# Altium schematic sheet Sheet2.SchDoc
size A4; SheetNumber: 2; SheetTotal: 2
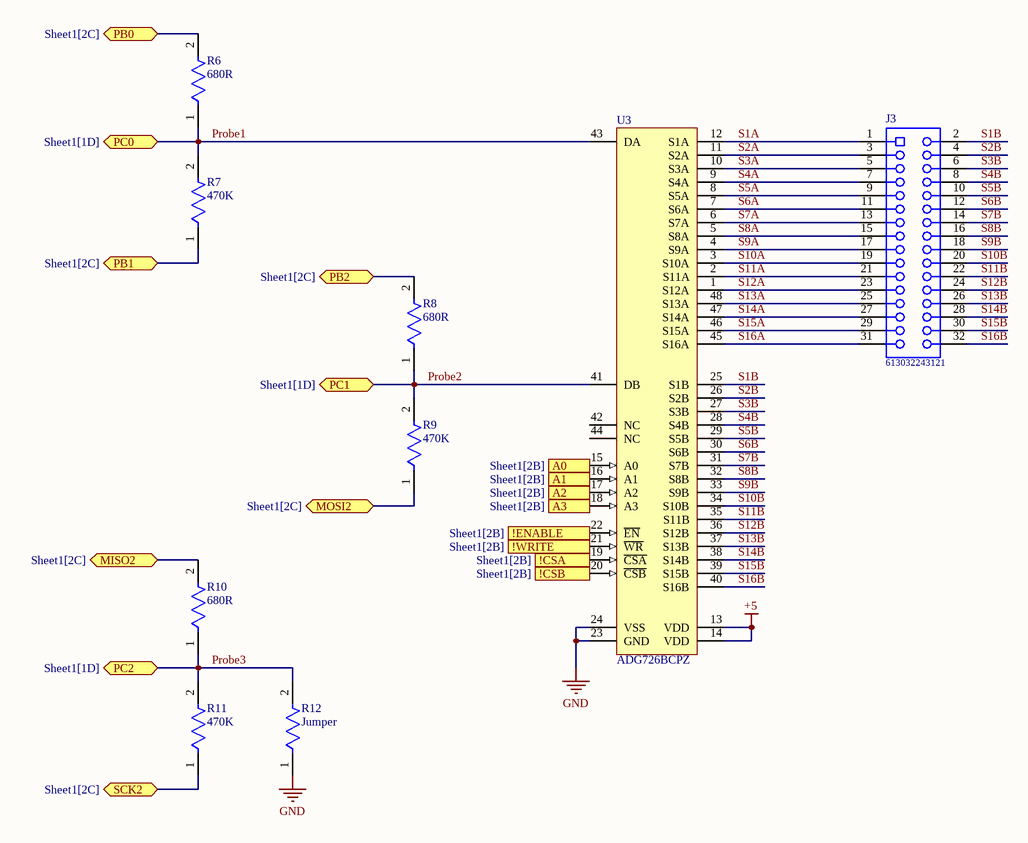
[diagram p0: Sheet2.SchDoc]

## Parts
J3  613032243121  [613032243121]
R6  680R  [FP-RMCF0805-IPC_B]  (no BOM)
R7  470K  [FP-RMCF0805-IPC_B]  (no BOM)
R8  680R  [FP-RMCF0805-IPC_B]  (no BOM)
R9  470K  [FP-RMCF0805-IPC_B]  (no BOM)
R10  680R  [FP-RMCF0805-IPC_B]  (no BOM)
R11  470K  [FP-RMCF0805-IPC_B]  (no BOM)
R12  Jumper  [FP-RMCF0805-IPC_B]  (no BOM)
U3  ADG726BCPZ  [ADG726 Breakout]  (no BOM)

## Ports
!CSA (in, see Sheet1[2B]), !CSB (in, see Sheet1[2B]), !ENABLE (in, see Sheet1[2B]), !WRITE (in, see Sheet1[2B]), A0 (in, see Sheet1[2B]), A1 (in, see Sheet1[2B]), A2 (in, see Sheet1[2B]), A3 (in, see Sheet1[2B]), MISO2 (bidir, see Sheet1[2C]), MOSI2 (bidir, see Sheet1[2C]), PB0 (bidir, see Sheet1[2C]), PB1 (bidir, see Sheet1[2C]), PB2 (bidir, see Sheet1[2C]), PC0 (bidir, see Sheet1[1D]), PC1 (bidir, see Sheet1[1D]), PC2 (bidir, see Sheet1[1D]), SCK2 (bidir, see Sheet1[2C])

## Nets
+5: U3.13(VDD) U3.14(VDD)
GND: R12.1 U3.23(GND) U3.24(VSS)
!CSA: U3.19(~{CSA}) ; port !CSA
!CSB: U3.20(~{CSB}) ; port !CSB
!ENABLE: U3.22(~{EN}) ; port !ENABLE
!WRITE: U3.21(~{WR}) ; port !WRITE
A0: U3.15(A0) ; port A0
A1: U3.16(A1) ; port A1
A2: U3.17(A2) ; port A2
A3: U3.18(A3) ; port A3
MISO2: R10.2 ; port MISO2
MOSI2: R9.1 ; port MOSI2
PB0: R6.2 ; port PB0
PB1: R7.1 ; port PB1
PB2: R8.2 ; port PB2
Probe1: R6.1 R7.2 U3.43(DA) ; port PC0
Probe2: R8.1 R9.2 U3.41(DB) ; port PC1
Probe3: R10.1 R11.2 R12.2 ; port PC2
S1A: J3.1 U3.12(S1A)
S1B: J3.2 U3.25(S1B)
S2A: J3.3 U3.11(S2A)
S2B: J3.4 U3.26(S2B)
S3A: J3.5 U3.10(S3A)
S3B: J3.6 U3.27(S3B)
S4A: J3.7 U3.9(S4A)
S4B: J3.8 U3.28(S4B)
S5A: J3.9 U3.8(S5A)
S5B: J3.10 U3.29(S5B)
S6A: J3.11 U3.7(S6A)
S6B: J3.12 U3.30(S6B)
S7A: J3.13 U3.6(S7A)
S7B: J3.14 U3.31(S7B)
S8A: J3.15 U3.5(S8A)
S8B: J3.16 U3.32(S8B)
S9A: J3.17 U3.4(S9A)
S9B: J3.18 U3.33(S9B)
S10A: J3.19 U3.3(S10A)
S10B: J3.20 U3.34(S10B)
S11A: J3.21 U3.2(S11A)
S11B: J3.22 U3.35(S11B)
S12A: J3.23 U3.1(S12A)
S12B: J3.24 U3.36(S12B)
S13A: J3.25 U3.48(S13A)
S13B: J3.26 U3.37(S13B)
S14A: J3.27 U3.47(S14A)
S14B: J3.28 U3.38(S14B)
S15A: J3.29 U3.46(S15A)
S15B: J3.30 U3.39(S15B)
S16A: J3.31 U3.45(S16A)
S16B: J3.32 U3.40(S16B)
SCK2: R11.1 ; port SCK2

Not connected (* = marked no-connect by the designer): U3 42(NC) 44(NC)

## Library data of the parts
J3 = CMP-1502-01445-1: THT Angled Socket Header WR-PHD, Pitch 2.54 mm, Dual Row, 32 pins; Manufacturer: Wurth Elektronik; Pitch: 2.54mm; Contact Resistance: 20mOhm; Gender: Female; Withstanding Voltage: 500VAC; Rated Current: 3A; Working Voltage: 250VAC; Pin Number: 32; Publisher: WurthElektronik; Part Number: 613032243121; Manufacturer URL: http://www.we-online.de; Package Reference: 613032243121; Operating Temperature: -40to125degC; Mounting Technology: THT; Packaging: Tray; Datasheet URL: https://katalog.we-online.de/em/datasheet/6130xx243121.pdf; Row Number: Dual; Orientation: Angled
R6-R12 = CMP-26527-000017-1: RES 0 OHM JUMPER 1/8W 0805; Power Rating: 125mW; Resistance: 0mR; Depth: 1.25mm; Length: 2mm; Military Standard: Not; Width: 0.049inch; Case Code (Imperial): 0805; Number of Terminations: 2; Mount: Surface Mount; Contact Plating: Tin; Height: 0.026inch; Case/Package: 0805; Min Operating Temperature: -55°C; Composition: Thick Film; Max Operating Temperature: 155°C; Packaging: Tape and Reel; Features: Automotive AEC-Q200; Max Power Dissipation: 125mW; Radiation Hardening: No; Lead Free: Lead Free; Case Code (Metric): 2012
U3 = CMP-0798-00018-1: 1.8 to 5.5 V / +/-2.5 V, 4 Ohm, 16-Channel Analog Multiplexer, -40 to 85 degC, 48-pin QFN (CP-48-1), Tray; Manufacturer: Analog Devices; Ron (ohms): 4; Supply V Guar Performance: Dual_(+/-2.5V), Single_(+3V), Single_(+5V); Bandwidth (Hz): 34M; Max Analog Signal Range: Vss to Vdd; t transition (s): 23n; PackageDescription: 48-Pin Lead Frame Chip Scale Package, Body 7 x 7 mm, Pitch 0.5 mm; ComponentLink3URL: http:/www.analog.com/static/imported-files/packages/PKG_PDF/LFCSP(CP)/CP-48/CP_48_1.pdf; Code_JEDEC: MO-220-VKKD-2; ComponentLink2Description: Datasheet; PackageReference: CP-48-1; ComponentLink2URL: http://www.analog.com/static/imported-files/data_sheets/ADG726_732.pdf; DatasheetVersion: Rev. 0; PartNumber: ADG726BCPZ; ComponentLink3Description: Package Specification; Packing: Tray; ComponentLink1URL: http://www.analog.com/en/index.html; ComponentLink1Description: Manufacturer URL; Mounting Technology: Surface Mount